# EAGLE board scooter (EAGLE 4.11)
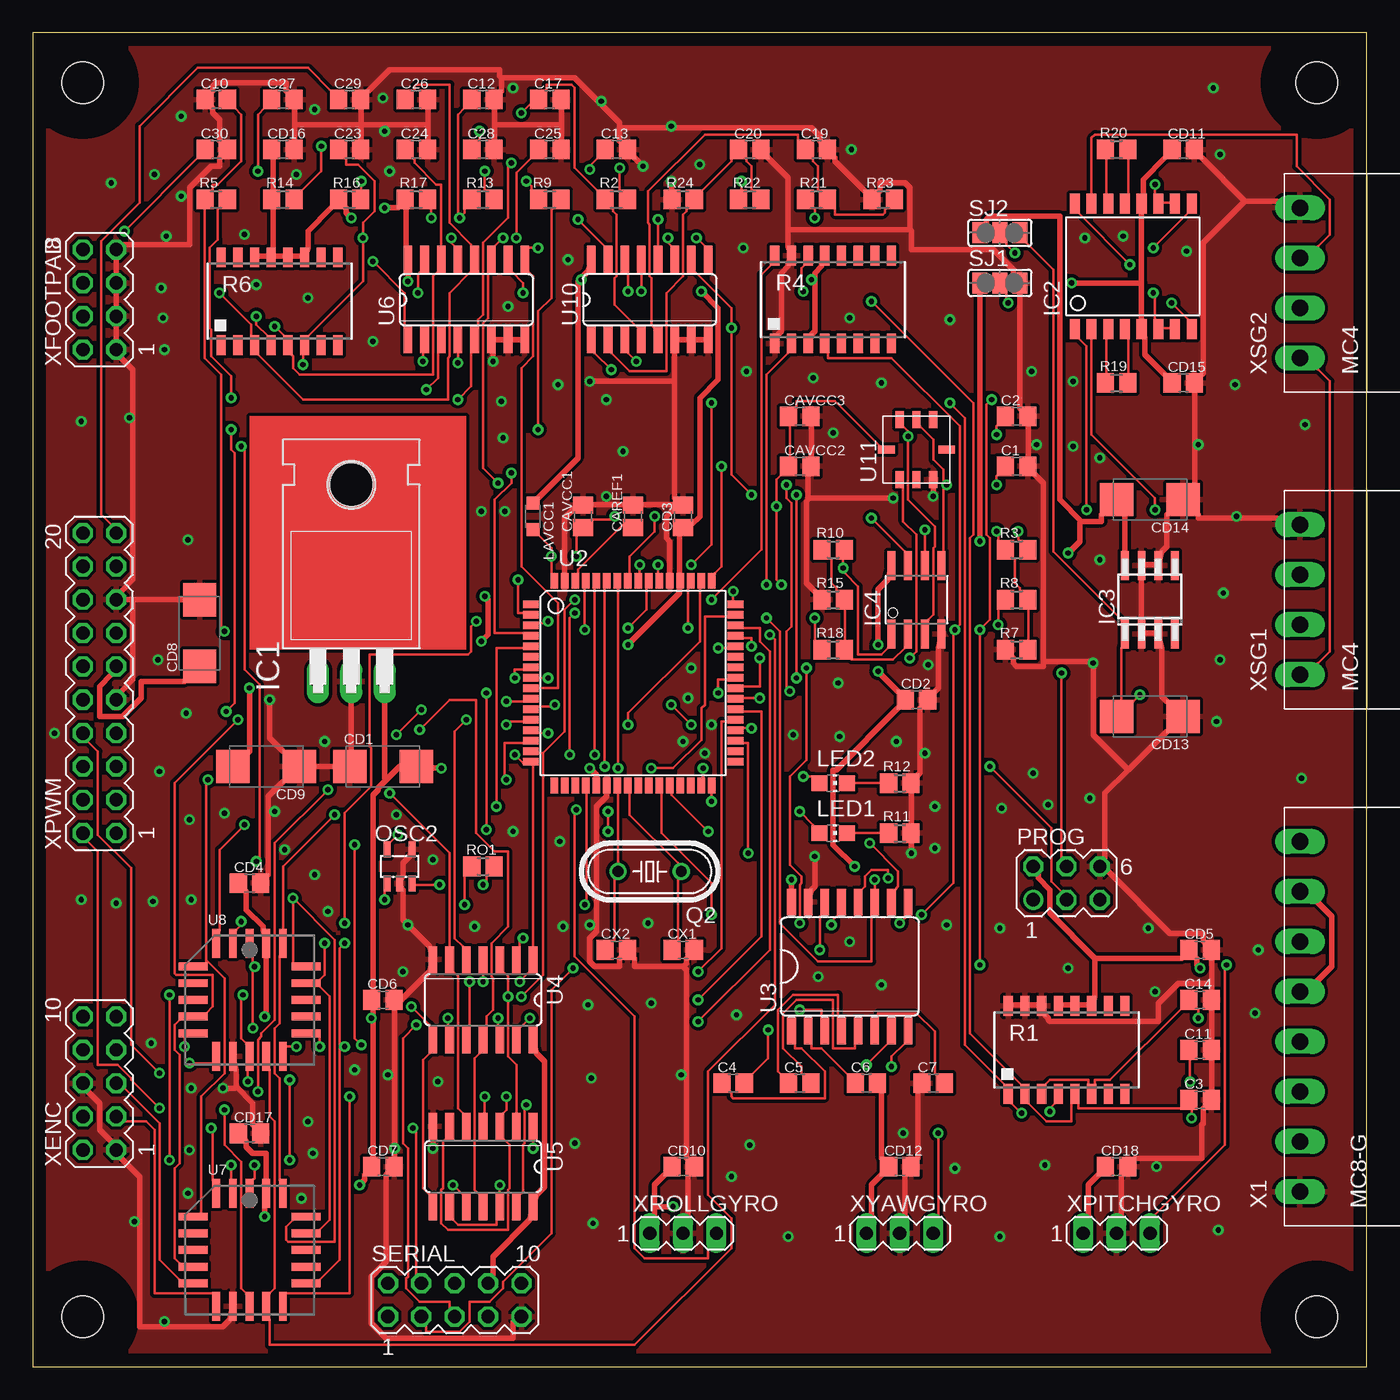
[diagram p5: board, top side]
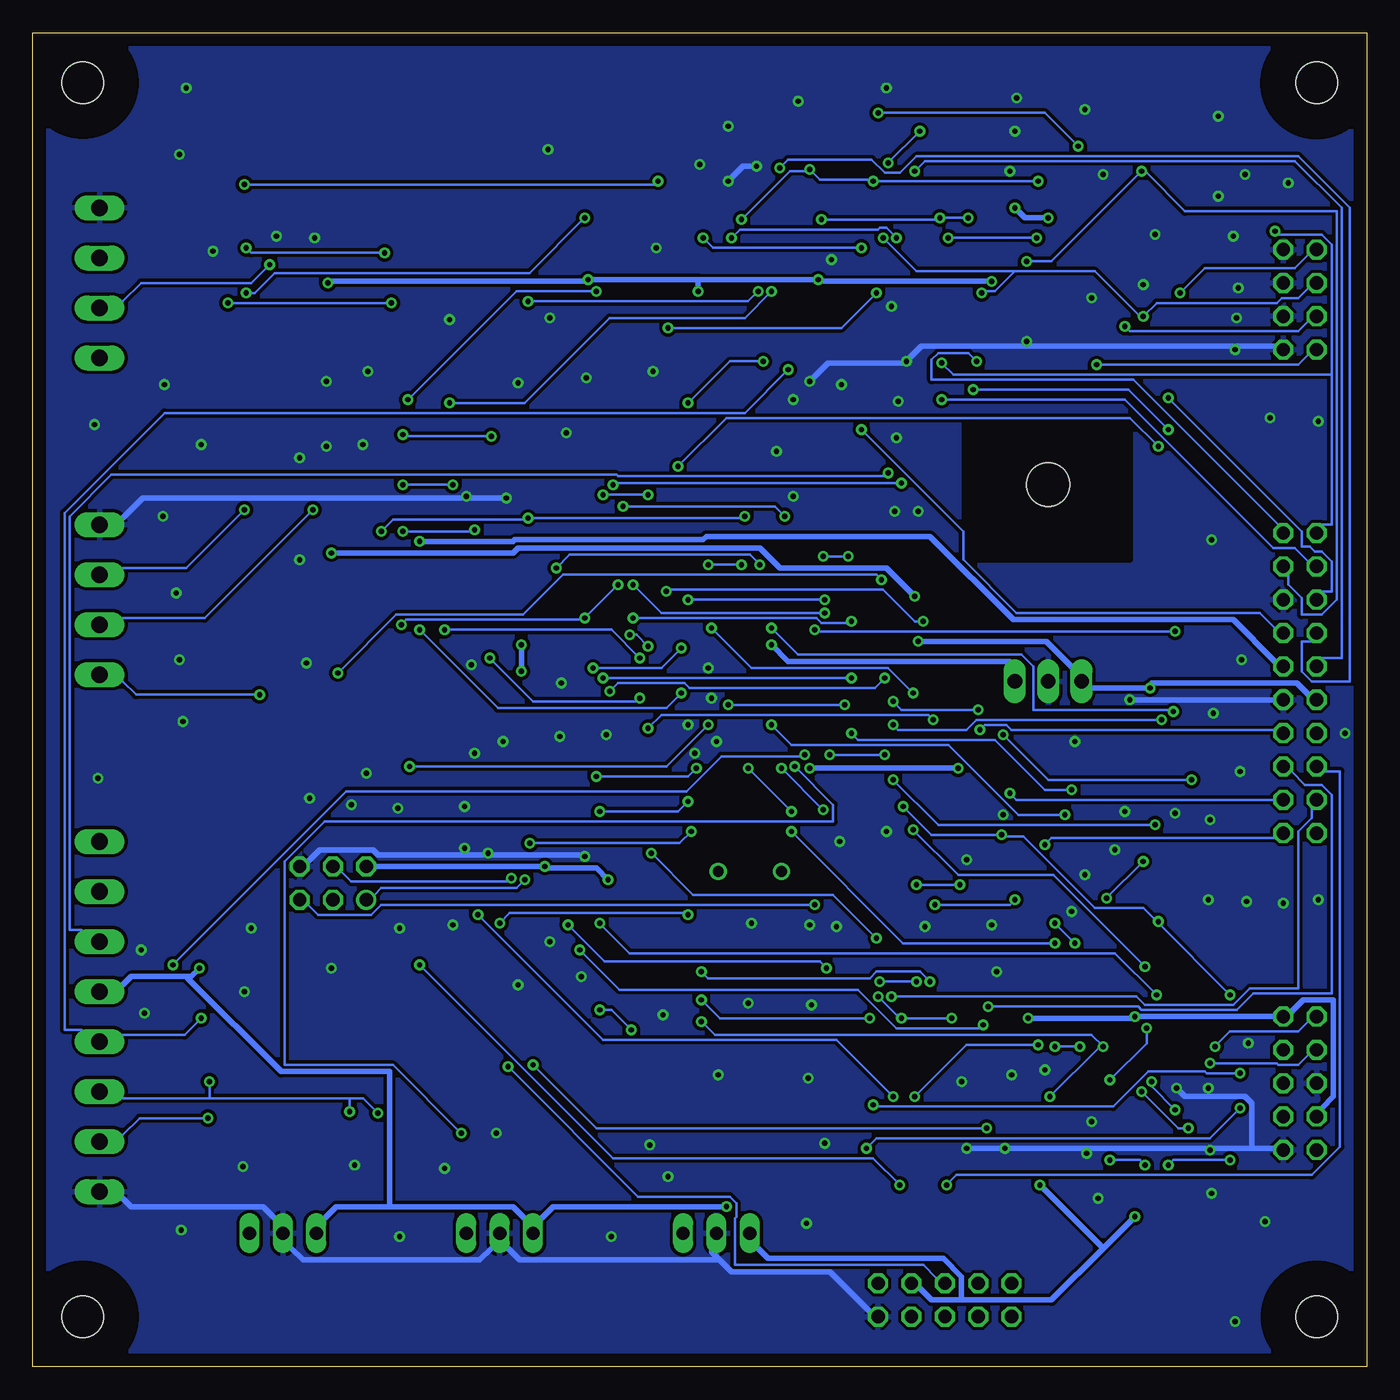
[diagram p6: board, bottom side, seen from below]

Size 101.6 x 101.6 mm. Coordinates in mm from the lower left corner, seen from the top.
Outline: 0,0 101.6,0 101.6,101.6 0,101.6 0,0
Copper layers (1*16): Top 0.035mm / dielectric 1.5mm / Bottom 0.035mm
Design rules "default": minimum track width 7mil, minimum drill 16mil, track to track 8mil, track to pad 8mil, pad to pad 8mil, via to via 8mil, smd to smd 8mil, copper to edge 40mil, drill to drill 8mil, minimum pad ring 10mil, minimum via ring 8mil, stop-mask expansion 4mil, vias tented up to drill 0mil, thermal gap 10mil
Net classes: 1 pwr: width 0.406 mm; 2 bigpwr: width 0.914 mm, clearance 0.813 mm; 3 ugpwr: width 0.61 mm, clearance 0.61 mm
Holes 3.17 mm at 3.81,97.79 97.79,3.81 3.81,3.81 97.79,97.79
tRestrict: area 0,94 to 7.6,101.6; area 94,94 to 101.6,101.6; area 94,0 to 101.6,7.6; area 0,0 to 7.6,7.6
bRestrict: area 18,61.5 to 30.6,72.1; area 0,94 to 7.6,101.6; area 94,94 to 101.6,101.6; area 94,0 to 101.6,7.6; area 0,0 to 7.6,7.6

## Footprints (pad centres in the part's own frame; a part is rotated, then mirrored left to right if it is on the bottom)
C0805 = smd 1.3 x 1.5: 1 -0.85,0; 2 0.85,0
C/6032-28R = smd 2.55 x 2.5: + 2.525,0; - -2.525,0
TO220H = drill 1.118 long: 1 -2.54,-10.16; 2 0,-10.16; 3 2.54,-10.16 | hole 3.302: 0,4.826
SO16-1 = smd 0.762 x 1.524: 1 -4.445,-4.775; 2 -3.175,-4.775; 3 -1.905,-4.775; 4 -0.635,-4.775; 5 0.635,-4.775; 6 1.905,-4.775; 7 3.175,-4.775; 8 4.445,-4.775; 9 4.445,4.775; 10 3.175,4.775; 11 1.905,4.775; 12 0.635,4.775; 13 -0.635,4.775; 14 -1.905,4.775; 15 -3.175,4.775; 16 -4.445,4.775
SO08 = smd 0.6 x 2.2: 1 -1.905,-2.6; 2 -0.635,-2.6; 3 0.635,-2.6; 4 1.905,-2.6; 5 1.905,2.6; 6 0.635,2.6; 7 -0.635,2.6; 8 -1.905,2.6
SO08' = smd 0.61 x 2.21: 1 -1.905,-2.616; 2 -0.635,-2.616; 3 0.635,-2.616; 4 1.905,-2.616; 5 1.905,2.616; 6 0.635,2.616; 7 -0.635,2.616; 8 -1.905,2.616
L2012C = smd 1 x 1: 1 -1,0; 2 1,0
CHIP-LED0805 = smd 1.2 x 1.2: A 0,-1.05; C 0,1.05
SOT23-5L = smd 0.55 x 1.2: 1 -0.95,-1.3; 2 0,-1.3; 3 0.95,-1.3; 4 0.95,1.3; 5 -0.95,1.3
MA03-2 = drill 1.016 round: 1 -2.54,-1.27 | drill 1.016 octagon: 2 -2.54,1.27; 3 0,-1.27; 4 0,1.27; 5 2.54,-1.27; 6 2.54,1.27
HC49/S = drill 0.813 round: 1 -2.413,0; 2 2.413,0
4816P = smd 0.7 x 1.5: 1 -4.445,-3.346; 2 -3.175,-3.346; 3 -1.905,-3.346; 4 -0.635,-3.346; 5 0.635,-3.346; 6 1.905,-3.346; 7 3.175,-3.346; 8 4.445,-3.346; 9 4.445,3.346; 10 3.175,3.346; 11 1.905,3.346; 12 0.635,3.346; 13 -0.635,3.346; 14 -1.905,3.346; 15 -3.175,3.346; 16 -4.445,3.346
R0805 = smd 1.3 x 1.5: 1 -0.85,0; 2 0.85,0
MA05-2 = drill 1.016 octagon: 1 -5.08,-1.27; 2 -5.08,1.27; 3 -2.54,-1.27; 4 -2.54,1.27; 5 0,-1.27; 6 0,1.27; 7 2.54,-1.27; 8 2.54,1.27; 9 5.08,-1.27; 10 5.08,1.27
SJ_2 = smd 1.168 x 1.6: 1 -1.524,0; 2 0,0; 3 1.524,0
TQFP64 = smd 1.194 x 0.559: 1 -7.8,6; 2 -7.8,5.2; 3 -7.8,4.4; 4 -7.8,3.6; 5 -7.8,2.8; 6 -7.8,2; 7 -7.8,1.2; 8 -7.8,0.4; 9 -7.8,-0.4; 10 -7.8,-1.2; 11 -7.8,-2; 12 -7.8,-2.8; 13 -7.8,-3.6; 14 -7.8,-4.4; 15 -7.8,-5.2; 16 -7.8,-6; 33 7.8,-6; 34 7.8,-5.2; 35 7.8,-4.4; 36 7.8,-3.6; 37 7.8,-2.8; 38 7.8,-2; 39 7.8,-1.2; 40 7.8,-0.4; 41 7.8,0.4; 42 7.8,1.2; 43 7.8,2; 44 7.8,2.8; 45 7.8,3.6; 46 7.8,4.4; 47 7.8,5.2; 48 7.8,6 | smd 0.559 x 1.194: 17 -6,-7.8; 18 -5.2,-7.8; 19 -4.4,-7.8; 20 -3.6,-7.8; 21 -2.8,-7.8; 22 -2,-7.8; 23 -1.2,-7.8; 24 -0.4,-7.8; 25 0.4,-7.8; 26 1.2,-7.8; 27 2,-7.8; 28 2.8,-7.8; 29 3.6,-7.8; 30 4.4,-7.8; 31 5.2,-7.8; 32 6,-7.8; 49 6,7.8; 50 5.2,7.8; 51 4.4,7.8; 52 3.6,7.8; 53 2.8,7.8; 54 2,7.8; 55 1.2,7.8; 56 0.4,7.8; 57 -0.4,7.8; 58 -1.2,7.8; 59 -2,7.8; 60 -2.8,7.8; 61 -3.6,7.8; 62 -4.4,7.8; 63 -5.2,7.8; 64 -6,7.8
SO16L = smd 0.66 x 2.032: 1 -4.445,-4.902; 2 -3.175,-4.902; 3 -1.905,-4.902; 4 -0.635,-4.902; 5 0.635,-4.902; 6 1.905,-4.902; 7 3.175,-4.902; 8 4.445,-4.902; 9 4.445,4.902; 10 3.175,4.902; 11 1.905,4.902; 12 0.635,4.902; 13 -0.635,4.902; 14 -1.905,4.902; 15 -3.175,4.902; 16 -4.445,4.902
SO14 = smd 0.66 x 2.032: 1 -3.81,-3.073; 2 -2.54,-3.073; 3 -1.27,-3.073; 4 0,-3.073; 5 1.27,-3.073; 6 2.54,-3.073; 7 3.81,-3.073; 8 3.81,3.073; 9 2.54,3.073; 10 1.27,3.073; 11 0,3.073; 12 -1.27,3.073; 13 -2.54,3.073; 14 -3.81,3.073
SO16 = smd 0.66 x 2.032: 1 -4.445,-3.073; 2 -3.175,-3.073; 3 -1.905,-3.073; 4 -0.635,-3.073; 5 0.635,-3.073; 6 1.905,-3.073; 7 3.175,-3.073; 8 4.445,-3.073; 9 4.445,3.073; 10 3.175,3.073; 11 1.905,3.073; 12 0.635,3.073; 13 -0.635,3.073; 14 -1.905,3.073; 15 -3.175,3.073; 16 -4.445,3.073
PLCC20 = smd 0.6 x 2.2: 1 0,4.3; 2 -1.27,4.3; 3 -2.54,4.3; 9 -2.54,-4.3; 10 -1.27,-4.3; 11 0,-4.3; 12 1.27,-4.3; 13 2.54,-4.3; 19 2.54,4.3; 20 1.27,4.3 | smd 2.2 x 0.6: 4 -4.3,2.54; 5 -4.3,1.27; 6 -4.3,0; 7 -4.3,-1.27; 8 -4.3,-2.54; 14 4.3,-2.54; 15 4.3,-1.27; 16 4.3,0; 17 4.3,1.27; 18 4.3,2.54
E-8 = smd 1.27 x 0.635: 1 -2.286,1.27; 2 -2.286,0; 3 -2.286,-1.27; 5 2.286,-1.27; 6 2.286,0; 7 2.286,1.27 | smd 0.635 x 1.27: 4 0,-2.286; 8 0,2.286
MC8-G = drill 1.27 long: 1 -13.335,0; 2 -9.525,0; 3 -5.715,0; 4 -1.905,0; 5 1.905,0; 6 5.715,0; 7 9.525,0; 8 13.335,0
MA04-2 = drill 1.016 octagon: 1 -3.81,-1.27; 2 -3.81,1.27; 3 -1.27,-1.27; 4 -1.27,1.27; 5 1.27,-1.27; 6 1.27,1.27; 7 3.81,-1.27; 8 3.81,1.27
MA03-1 = drill 1.016 long: 1 -2.54,0; 2 0,0; 3 2.54,0
MA10-2 = drill 1.016 octagon: 1 -11.43,-1.27; 2 -11.43,1.27; 3 -8.89,-1.27; 4 -8.89,1.27; 5 -6.35,-1.27; 6 -6.35,1.27; 7 -3.81,-1.27; 8 -3.81,1.27; 9 -1.27,-1.27; 10 -1.27,1.27; 11 1.27,-1.27; 12 1.27,1.27; 13 3.81,-1.27; 14 3.81,1.27; 15 6.35,-1.27; 16 6.35,1.27; 17 8.89,-1.27; 18 8.89,1.27; 19 11.43,-1.27; 20 11.43,1.27
MC4 = drill 1.27 long: 1 -5.715,0; 2 -1.905,0; 3 1.905,0; 4 5.715,0

## Placement (x,y rotation side)
C1  0.22uF  [C0805]  74.93,68.58 0 top
C2  0.22uF  [C0805]  74.93,72.39 0 top
C3  0.1uF  [C0805]  88.9,20.32 0 top
C4  1.0uF  [C0805]  53.34,21.59 0 top
C5  1.0uF  [C0805]  58.42,21.59 0 top
C6  1.0uF  [C0805]  63.5,21.59 0 top
C7  1.0uF  [C0805]  68.58,21.59 0 top
C10  0.1uF  [C0805]  13.97,96.52 0 top
C11  0.1uF  [C0805]  88.9,24.13 0 top
C12  0.1uF  [C0805]  34.29,96.52 0 top
C13  0.1uF  [C0805]  44.45,92.71 0 top
C14  0.1uF  [C0805]  88.9,27.94 0 top
C17  0.1uF  [C0805]  39.37,96.52 0 top
C19  1.0uF  [C0805]  59.69,92.71 0 top
C20  1.0uF  [C0805]  54.61,92.71 0 top
C23  0.1uF  [C0805]  24.13,92.71 0 top
C24  0.1uF  [C0805]  29.21,92.71 0 top
C25  0.1uF  [C0805]  39.37,92.71 0 top
C26  0.1uF  [C0805]  29.21,96.52 0 top
C27  0.1uF  [C0805]  19.05,96.52 0 top
C28  0.1uF  [C0805]  34.29,92.71 0 top
C29  0.1uF  [C0805]  24.13,96.52 0 top
C30  0.1uF  [C0805]  13.97,92.71 0 top
CAREF1  0.1uF  [C0805]  45.72,64.77 90 top
CAVCC1  0.1uF  [C0805]  41.91,64.77 90 top
CAVCC2  0.1uF  [C0805]  58.42,68.58 0 top
CAVCC3  0.1uF  [C0805]  58.42,72.39 0 top
CD1  10uF 25v  [C/6032-28R]  26.67,45.72 0 top
CD2  0.1uF  [C0805]  67.31,50.8 0 top
CD3  0.1uF  [C0805]  49.53,64.77 90 top
CD4  0.1uF  [C0805]  16.51,36.83 0 top
CD5  0.1uF  [C0805]  88.9,31.75 0 top
CD6  0.1uF  [C0805]  26.67,27.94 0 top
CD7  0.1uF  [C0805]  26.67,15.24 0 top
CD8  10uF 25v  [C/6032-28R]  12.7,55.88 90 top
CD9  10uF 25v  [C/6032-28R]  17.78,45.72 180 top
CD10  0.1uF  [C0805]  49.53,15.24 0 top
CD11  0.1uF  [C0805]  87.63,92.71 0 top
CD12  0.1uF  [C0805]  66.04,15.24 0 top
CD13  10uF 25v  [C/6032-28R]  85.09,49.53 180 top
CD14  10uF 25v  [C/6032-28R]  85.09,66.04 180 top
CD15  0.1uF  [C0805]  87.63,74.93 0 top
CD16  0.1uF  [C0805]  19.05,92.71 0 top
CD17  0.1uF  [C0805]  16.51,17.78 0 top
CD18  0.1uF  [C0805]  82.55,15.24 0 top
CX1  18p  [C0805]  49.53,31.75 0 top
CX2  18p  [C0805]  44.45,31.75 0 top
IC1  7805T  [TO220H]  24.26,62.36 0 top
IC2  INA2128U  [SO16-1]  83.82,83.82 0 top
IC3  TL750L010C  [SO08]  85.09,58.42 0 top
IC4  OPA2340U  [SO08']  67.31,58.42 0 top
LAVCC1  10uH  [L2012C]  38.1,64.77 270 top
LED1  [CHIP-LED0805]  60.96,40.64 270 top
LED2  [CHIP-LED0805]  60.96,44.45 270 top
OSC2  LTC1799S5  [SOT23-5L]  27.94,38.1 0 top
PROG  [MA03-2]  78.74,36.83 0 top
Q2  14.7  [HC49/S]  46.99,37.72 180 top
R1  10k  [4816P]  78.74,24.13 0 top
R2  10k 0.1%  [R0805]  44.45,88.9 0 top
R3  10k 1%  [R0805]  74.93,62.23 0 top
R4  10k  [4816P]  60.96,81.28 0 top
R5  10k  [R0805]  13.97,88.9 0 top
R6  4.7k  [4816P]  18.8,81.15 0 top
R7  10k 1%  [R0805]  74.93,54.61 0 top
R8  10k 1%  [R0805]  74.93,58.42 0 top
R9  10k 0.1%  [R0805]  39.37,88.9 0 top
R10  10k 1%  [R0805]  60.96,62.23 0 top
R11  1k  [R0805]  66.04,40.64 0 top
R12  1k  [R0805]  66.04,44.45 0 top
R13  10k 0.1%  [R0805]  34.29,88.9 0 top
R14  10k 0.1%  [R0805]  19.05,88.9 0 top
R15  10k 1%  [R0805]  60.96,58.42 0 top
R16  10k 0.1%  [R0805]  24.13,88.9 0 top
R17  10k 0.1%  [R0805]  29.21,88.9 0 top
R18  10k 1%  [R0805]  60.96,54.61 0 top
R19  400  [R0805]  82.55,74.93 0 top
R20  400  [R0805]  82.55,92.71 0 top
R21  10k 0.1%  [R0805]  59.69,88.9 0 top
R22  10k 0.1%  [R0805]  54.61,88.9 0 top
R23  10k 0.1%  [R0805]  64.77,88.9 0 top
R24  10k 0.1%  [R0805]  49.53,88.9 0 top
RO1  10k 1%  [R0805]  34.29,38.1 0 top
SERIAL  [MA05-2]  32.13,5.08 0 top
SJ1  [SJ_2]  73.66,82.55 0 top
SJ2  [SJ_2]  73.66,86.36 0 top
U2  MEGA128-A  [TQFP64]  45.72,52.07 0 top
U3  MAX232ECWE  [SO16L]  62.23,30.48 0 top
U4  74HC08D  [SO14]  34.29,27.94 180 top
U5  74HC02D  [SO14]  34.29,15.24 180 top
U6  4051D  [SO16]  33.02,81.28 0 top
U7  HCTL-2016#PLC  [PLCC20]  16.51,8.89 0 top
U8  HCTL-2016#PLC  [PLCC20]  16.51,27.94 0 top
U10  4051D  [SO16]  46.99,81.28 0 top
U11  ADXL311JE  [E-8]  67.31,69.85 90 top
X1  MC8-G  [MC8-G]  96.52,26.67 90 top
XENC  [MA05-2]  5.08,21.59 90 top
XFOOTPAD  [MA04-2]  5.08,81.28 90 top
XPITCHGYRO  [MA03-1]  82.55,10.16 0 top
XPWM  [MA10-2]  5.08,52.07 90 top
XROLLGYRO  [MA03-1]  49.53,10.16 0 top
XSG1  MC4  [MC4]  96.52,58.42 90 top
XSG2  MC4  [MC4]  96.52,82.55 90 top
XYAWGYRO  [MA03-1]  66.04,10.16 0 top

## Tracks (layer width: path | path; a pad name or v marks a point on that pad's centre or on a via)
+15V  (via drill 0.41)
  Top 0.406: v16.51,51.69 16.51,46.86 CD9.+ | 79.88,64.39 78.23,66.04 78.23,87.63 72.9,87.63 72.64,87.38 72.64,87.12 SJ2.1 | 79.88,64.39 81.41,64.39 81.41,64.9 CD14.+ 83.19,64.9 IC3.8 | v34.16,55.24 34.67,55.75 34.67,58.42 v34.42,58.67 | v78.87,61.98 79.76,62.87 79.76,64.26 79.88,64.39
  Bottom 0.406: XPWM.10 4.45,51.18 5.33,52.07 16.38,52.07 v16.51,51.69 20.95,51.69 IC1.1 22.48,53.34 24.38,55.24 v34.16,55.24 | v34.42,58.67 36.58,60.83 44.7,60.83 46.23,62.36 64.64,62.36 65.02,61.98 v78.87,61.98
-15V  (via drill 0.41)
  Top 0.406: v72.14,62.87 SJ1.1 | CD8.- 11.56,52.2 8.26,52.2 8.26,50.93 6.86,49.53 5.08,49.53 5.08,51.82 5.97,52.7 XPWM.11
  Bottom 0.406: v72.14,62.87 65.02,62.87 64.9,62.99 50.55,62.99 50.29,63.25 33.27,63.25 26.92,56.9 10.16,56.9 6.99,53.72 XPWM.11
/RESET  (via drill 0.41)
  Top 0.178: v42.04,35.18 42.16,35.31 42.16,43.69 U2.20
  Bottom 0.178: v42.04,35.18 75.06,35.18 75.82,34.42 79.88,34.42 80.64,35.18 PROG.5
ACCEL_ST  (via drill 0.41)
  Top 0.178: v55.37,50.93 54.1,50.93 U2.39 | v66.8,53.98 67.31,54.48 67.31,63.37 66.29,64.39 66.29,67.06 U11.1
  Bottom 0.178: v55.37,50.93 55.63,50.67 63.5,50.67 v66.8,53.98
ADCMUX1  (via drill 0.41)
  Top 0.178: v47.62,61.09 47.62,60.45 U2.54 | v50.16,61.09 51.69,62.61 v51.69,73.41 | v45.97,76.58 45.34,77.22 U10.3
  Bottom 0.178: v47.62,61.09 v50.16,61.09 | v51.69,73.41 48.51,76.58 v45.97,76.58
ADCMUX2  (via drill 0.41)
  Top 0.178: v45.34,56.26 46.74,57.66 46.74,59.31 U2.55 | v14.73,49.91 15.37,50.55 15.37,69.6 15.11,69.85 v15.11,71.37 | v29.97,74.42 30.86,75.31 30.86,77.22 U6.3
  Bottom 0.178: v45.34,56.26 43.31,54.23 26.29,54.23 25.4,53.34 25.4,50.04 14.86,50.04 v14.73,49.91 | v15.11,71.37 18.16,74.42 v29.97,74.42
AHI1  (via drill 0.41)
  Top 0.178: U5.2 36.83,22.99 36.2,23.62 v36.2,28.19 36.2,29.72 35.81,30.1 U4.3
  Bottom 0.178: v36.2,28.19 17.53,28.19 16.89,27.56 10.16,27.56 8.89,28.83 5.21,28.83 5.21,40.77 4.19,41.78 4.19,42.55 XPWM.4
AHI2  (via drill 0.41)
  Top 0.178: U5.8 30.23,13.08 29.72,13.59 29.72,23.37 30.23,23.88 U4.8 30.23,25.78 30.23,26.04 v28.83,27.43
  Bottom 0.178: v28.83,27.43 17.4,27.43 17.14,27.18 9.91,27.18 8.64,28.45 2.67,28.45 2.67,43.56 3.43,44.32 4.7,44.32 5.71,45.34 XPWM.5
ALO1  (via drill 0.41)
  Top 0.178: v9.65,19.68 7.49,21.84 7.49,21.97 6.48,22.99 4.95,22.99 4.95,39.24 4.19,40.01 XPWM.2 | v38.1,16.64 U5.1
  Bottom 0.178: v38.1,16.64 37.34,17.4 11.94,17.4 v9.65,19.68
ALO2  (via drill 0.41)
  Top 0.178: v32,13.84 32.77,13.08 U5.10
  Bottom 0.178: v32,13.84 31.24,14.61 4.19,14.61 2.03,16.76 2.03,45.34 3.17,45.34 XPWM.6
AREF
  Top 0.178: U2.62 41.53,60.45 41.53,60.71 45.09,64.26 CAREF1.1
AVCC1  (via drill 0.41)
  Top 0.178: U11.8 64.52,70.1 61.09,73.53 58.17,73.53 58.17,73.03 CAVCC3.1 57.66,71.75 57.66,69.22 CAVCC2.1 57.02,67.94 56.64,67.56 v56.64,65.53 56.64,59.94 v57.02,59.56 | LAVCC1.2 38.48,63.37 39.5,62.36 v39.5,61.72 39.5,60.45 U2.64 | v41.4,61.72 41.4,63.37 CAVCC1.1 42.55,64.52 44.32,64.52 v44.32,64.77 | v59.56,57.02 59.56,55.24 R18.1 | v73.53,56.52 73.53,57.78 R8.1
  Bottom 0.178: v39.5,61.72 v41.4,61.72 | v57.02,59.56 v59.56,57.02 59.94,56.9 73.15,56.9 v73.53,56.52 | v44.32,64.77 45.09,65.53 v56.64,65.53
BAT_VOLTAGE  (via drill 0.41)
  Top 0.178: v42.04,56.13 42.04,59.31 U2.61 | v14.61,56.01 14.35,56.26 14.35,75.56 13.08,76.83 13.08,88.27 R5.1 13.72,89.53 13.72,90.04 14.1,90.04 15.88,91.82 15.88,95.38 15.37,95.89 C10.2
  Bottom 0.178: v42.04,56.13 41.91,56.01 v14.61,56.01
BATIS  (via drill 0.41)
  Top 0.178: v21.97,92.96 21.97,91.06 20.45,89.53 R14.2 | v37.21,95.5 37.97,96.27 C17.1 39.12,97.16 39.12,97.66 41.02,97.66 41.27,97.41 41.27,91.31 43.05,89.53 R2.1 44.2,88.27 44.2,88.01 44.45,87.76 44.45,83.06 44.32,82.93 44.32,80.9 46.1,79.12 U10.4
  Bottom 0.178: v21.97,92.96 24.51,95.5 v37.21,95.5
BATISIN  (via drill 0.41)
  Top 0.178: v44.7,91.31 44.7,89.53 R2.2
  Bottom 0.178: v44.7,91.31 44.07,91.95 37.72,91.95 36.7,90.93 35.56,90.93 34.29,92.2 5.21,92.2 1.27,88.27 1.27,52.2 4.19,52.2 4.95,52.96 4.95,55.24 4.19,55.24 XPWM.14
BEEPER  (via drill 0.41)
  Top 0.178: v36.45,68.07 36.45,67.31 35.18,66.04 35.18,55.88 37.34,55.88 U2.4
  Bottom 0.178: v36.45,68.07 36.7,67.82 57.02,67.82 57.15,67.94 95.63,67.94 98.81,64.77 98.81,33.27 97.92,33.27 X1.6
BHI1  (via drill 0.41)
  Top 0.178: U5.5 32.77,19.3 32.38,19.68 32.38,29.72 32,30.1 U4.6 31.75,39.12 v27.18,43.69
  Bottom 0.178: v27.18,43.69 26.67,43.18 XPWM.3
BHI2  (via drill 0.41)
  Top 0.178: U5.11 34.04,13.08 33.66,13.46 33.66,23.5 34.04,23.88 U4.11 34.54,25.78 34.54,26.67 35.05,27.18 35.05,29.59 34.92,29.72 34.92,32.26 36.2,33.53 36.2,39.24 35.18,39.24 33.78,40.64 33.78,50.8 31.75,50.8 v29.46,48.51
  Bottom 0.178: v29.46,48.51 29.08,48.9 27.43,48.9 27.05,48.51 6.99,48.51 XPWM.7
BLO1  (via drill 0.41)
  Top 0.178: v34.42,20.57 34.42,19.3 U5.4 | v25.02,24.51 24.51,25.02 v24.51,39.75
  Bottom 0.178: v34.42,20.57 30.48,24.51 v25.02,24.51 | v24.51,39.75 24,40.26 6.99,40.26 XPWM.1
BLO2  (via drill 0.41)
  Top 0.178: v37.59,19.94 37.47,19.81 37.47,17.02 37.34,16.89 37.34,13.34 37.08,13.08 U5.13 | v9.65,22.35 7.49,24.51 7.49,37.97 4.95,40.51 4.95,46.86 4.19,47.62 XPWM.8
  Bottom 0.178: v37.59,19.94 37.47,19.81 19.3,19.81 16.64,22.48 12.32,22.48 12.19,22.35 v9.65,22.35
D0  (via drill 0.41)
  Top 0.178: v49.91,56.26 49.91,59.31 U2.51 | v34.54,40.89 v34.54,51.31 | U8.1 16.76,31.24 16.76,30.61 v16.89,30.48 16.76,30.1 v16.76,25.78 | v16.89,15.37 16.89,14.35 16.76,14.22 U7.1 | v19.56,15.75 v19.56,21.84
  Bottom 0.178: v49.91,56.26 46.86,53.21 36.45,53.21 v34.54,51.31 | v34.54,40.89 31.11,37.47 23.88,37.47 v16.89,30.48 | v16.89,15.37 17.27,15.75 v19.56,15.75 | v19.56,21.84 16.76,24.64 v16.76,25.78
D1  (via drill 0.41)
  Top 0.178: v45.34,48.9 45.34,49.78 50.8,55.24 50.8,59.31 U2.50 | v22.99,42.04 19.05,38.1 U8.19 18.8,31.24 18.8,26.16 18.41,25.78 18.41,22.35 18.8,21.97 18.8,14.22 U7.19
  Bottom 0.178: v45.34,48.9 43.81,47.37 31.88,47.37 26.54,42.04 v22.99,42.04
D2  (via drill 0.41)
  Top 0.178: v52.45,68.58 52.45,60.96 51.94,60.45 U2.49 | v15.88,70.1 16.13,69.85 16.13,53.09 17.27,51.94 17.27,38.73 v17.02,38.48 | U8.18 19.81,30.73 v19.81,35.69 22.99,32.51 22.99,9.53 19.43,9.53 19.3,9.65 19.3,10.67 19.81,11.18 U7.18
  Bottom 0.178: v52.45,68.58 48.77,72.26 18.03,72.26 v15.88,70.1 | v19.81,35.69 v17.02,38.48
D3  (via drill 0.41)
  Top 0.178: v53.34,59.05 53.34,58.29 U2.48 | v33.78,56.77 33.4,56.39 33.4,54.48 33.15,54.23 25.65,54.23 25.65,47.24 25.78,47.12 25.78,44.2 23.75,42.16 v23.75,33.78 | v22.23,32.26 22.23,29.84 21.84,29.46 U8.17 21.84,28.96 22.61,28.19 22.61,11.18 21.84,10.41 U7.17
  Bottom 0.178: v53.34,59.05 53.21,59.18 36.83,59.18 34.42,56.77 v33.78,56.77 | v22.23,32.26 v23.75,33.78
D4  (via drill 0.41)
  Top 0.178: v47.12,45.59 48.77,45.59 50.93,47.75 50.93,50.16 51.18,50.42 51.18,57.15 52.96,57.15 U2.47 | v43.81,40.77 v43.81,42.29 | v23.75,32.26 23.37,31.88 23.37,24.38 | 23.37,24.38 23.37,8.13 21.84,6.6 U7.14 | v21.84,24.38 21.84,25.15 U8.14 | 23.37,24.38 v23.75,24.38
  Bottom 0.178: v43.81,42.29 v47.12,45.59 | v43.81,40.77 35.31,32.26 v23.75,32.26 | v23.75,24.38 v21.84,24.38
D5  (via drill 0.41)
  Top 0.178: v50.67,26.29 56.13,31.75 56.13,54.48 55.37,55.24 55.37,56.26 54.1,56.26 U2.46 | v20.07,24.38 19.3,24.38 U8.13 | v24.13,20.57 24.13,5.59 19.3,5.59 U7.13
  Bottom 0.178: v50.67,26.29 49.66,25.27 20.95,25.27 v20.07,24.38 20.45,24.26 v24.13,20.57
D6  (via drill 0.41)
  Top 0.178: v54.74,54.86 54.74,55.5 54.1,55.5 U2.45 | v56.13,55.75 56.52,55.37 56.52,27.56 51.44,22.48 51.44,13.08 53.21,11.3 53.21,9.02 45.85,1.65 18.03,1.65 18.03,3.56 U7.12 18.03,5.59 18.41,5.97 18.41,18.67 18.03,19.05 18.03,22.61 U8.12
  Bottom 0.178: v54.74,54.86 55.63,55.75 v56.13,55.75
D7  (via drill 0.41)
  Top 0.178: v52.2,54.74 52.96,54.74 U2.44 | v58.93,53.21 58.93,46.23 57.66,44.96 57.66,38.23 58.55,37.34 58.55,36.83 58.42,36.7 v58.42,33.78 | v16,28.32 15.88,28.19 15.88,25.02 16.26,24.64 U8.11 16.38,22.61 v16.38,21.72 | v14.61,19.56 14.61,16.89 15.88,15.62 15.88,5.97 16.26,5.59 U7.11
  Bottom 0.178: v52.2,54.74 53.72,53.21 v58.93,53.21 | v58.42,33.78 56.13,31.5 19.18,31.5 v16,28.32 | v14.61,19.56 16.38,21.34 v16.38,21.72
ENC1A
  Top 0.178: U7.9 13.72,5.59 9.27,5.59 9.27,18.03 8.64,18.67 6.99,18.67 XENC.3
ENC1B
  Top 0.178: U7.8 11.18,6.6 9.65,8.13 9.65,18.54 6.99,21.21 XENC.5
ENC2A  (via drill 0.41)
  Top 0.178: v11.94,23.11 13.72,23.11 U8.9
  Bottom 0.178: v11.94,23.11 6.86,23.11 6.73,22.99 5.21,22.99 4.45,23.75 XENC.8
ENC2B  (via drill 0.41)
  Top 0.178: v11.56,24.38 11.56,25.15 U8.8
  Bottom 0.178: v11.56,24.38 10.41,25.53 5.21,25.53 4.45,26.29 XENC.10
ENCCLK  (via drill 0.41)
  Top 0.178: v35.31,42.67 35.31,54.74 37.34,54.74 U2.5 | v27.81,40.51 27.18,39.88 OSC2.5 | v15.11,15.37 15.11,14.22 U7.2 | v10.41,15.75 v10.41,28.32 | v15.88,33.91 15.88,33.66 15.49,33.27 U8.2
  Bottom 0.178: v35.31,42.67 33.15,40.51 v27.81,40.51 27.43,40.39 26.16,40.39 20.7,34.92 17.02,34.92 16,33.91 | v15.11,15.37 14.73,15.75 v10.41,15.75 | v10.41,28.32 16,33.91 | 16,33.91 v15.88,33.91
EXTRAMUX0  (via drill 0.41)
  Top 0.178: v36.7,52.45 36.7,53.09 37.34,53.09 U2.7 | v57.66,51.44 57.4,51.69 57.4,56.01 57.78,56.39 57.78,65.79 57.4,66.17 v57.4,67.18 | v35.43,67.31 34.29,68.45 34.29,79.5 34.67,79.88 34.67,83.44 U6.11 35.18,85.34 v35.81,85.98 | v48.39,85.98 48.39,85.6 48.64,85.34 U10.11
  Bottom 0.178: v36.7,52.45 37.47,51.69 51.56,51.69 51.94,52.07 57.02,52.07 v57.66,51.44 | v57.4,67.18 57.28,67.31 v35.43,67.31 | v48.39,85.98 47.75,86.61 37.21,86.61 37.08,86.74 36.58,86.74 v35.81,85.98
EXTRAMUX1  (via drill 0.41)
  Top 0.178: v39.24,52.45 38.48,52.45 U2.8 | v58.17,52.45 v58.17,66.42 | v54.74,66.42 53.21,67.94 v53.21,79.12 53.21,80.64 50.42,83.44 U10.10 | v37.34,81.79 37.34,82.55 36.45,83.44 U6.10
  Bottom 0.178: v39.24,52.45 v58.17,52.45 | v58.17,66.42 v54.74,66.42 | v37.34,81.79 40.01,79.12 v53.21,79.12
EXTRAMUX2  (via drill 0.41)
  Top 0.178: U2.9 38.48,51.69 40.01,51.69 40.01,58.17 37.21,60.96 37.21,76.07 38.1,76.96 38.1,83.06 37.72,83.44 U6.9 37.72,85.22 v38.48,85.22 | v50.55,85.98 51.18,85.34 U10.9
  Bottom 0.178: v50.55,85.98 49.78,85.22 v38.48,85.22
FWD_ACCEL  (via drill 0.41)
  Top 0.178: v46.23,61.09 46.23,60.45 U2.56 | R10.2 61.72,61.59 v61.72,60.83 61.85,60.45 62.87,59.44 62.87,54.23 64.64,54.23 65.15,54.74 IC4.1
  Bottom 0.178: v46.23,61.09 46.99,61.85 60.71,61.85 v61.72,60.83
GND  (via drill 0.41)
  Top 0.406: U2.63 40.51,60.45 40.51,64.64 41.27,65.41 CAVCC1.2 42.55,65.66 45.09,65.66 CAREF1.2 46.35,65.66 48.9,65.66 CD3.2 | U10.8 51.18,78.23 50.42,78.23 U10.7 49.91,78.23 49.15,78.23 U10.6 48.9,75.06 | U2.53 48.51,60.45 48.51,62.87 48.26,63.12 48.26,64.77 48.9,65.41 CD3.2 | 48.9,75.06 48.9,66.17 CD3.2 | CD4.2 17.91,37.47 17.91,43.43 19.05,44.58 CD9.- | CD9.- CD1.- 24.26,46.86 IC1.2 | 7.62,58.42 11.56,58.42 CD8.+ | 7.62,58.42 XPWM.15 6.73,59.05 7.62,59.94 7.62,75.95 6.73,76.83 XFOOTPAD.1 XFOOTPAD.3 XFOOTPAD.5 XFOOTPAD.7 6.99,85.47 11.94,85.47 11.94,89.79 13.59,91.44 14.22,91.44 14.22,92.08 C30.2 14.22,93.34 14.22,95 13.72,95.5 13.72,95.89 C10.1 13.72,97.16 13.72,97.54 13.97,97.79 19.3,97.79 19.3,97.16 C27.2 19.94,95.89 19.94,94.61 | XPWM.9 6.73,51.44 7.62,52.32 7.62,58.42 | U6.8 37.21,78.23 36.45,78.23 U6.7 35.94,78.23 35.18,78.23 U6.6 35.05,77.22 v35.05,76.58 | v18.03,50.8 18.03,47.88 19.05,46.86 CD9.- | v42.42,75.06 48.9,75.06 | 76.96,53.72 76.96,67.31 76.33,67.94 C1.2 75.82,69.22 75.82,71.75 C2.2 75.18,73.03 SJ1.3 74.68,83.31 74.68,83.57 73.15,85.09 66.93,85.09 66.93,86.49 66.8,86.61 | 76.96,53.72 76.96,53.34 74.93,53.34 74.68,53.59 74.68,53.98 R7.1 | 30.1,94.61 30.1,95.89 C26.2 | 30.1,94.61 30.1,93.34 C24.2 | 19.94,94.61 19.94,93.34 CD16.2 | 25.02,94.61 25.02,95.89 C29.2 25.53,97.16 27.18,98.81 35.56,98.81 35.56,98.3 35.69,98.17 | 25.02,94.61 25.02,93.34 C23.2 | 25.02,94.61 19.94,94.61 | 25.02,94.61 30.1,94.61 | R4.1 56.77,78.61 57.02,78.87 57.02,83.31 57.53,83.82 57.53,83.95 R4.15 57.53,85.34 57.53,86.61 | 57.53,86.61 57.53,90.55 56.01,92.08 C20.2
  Top 0.406: 40.26,94.61 40.26,95.89 C17.2 | 40.26,94.61 40.26,93.34 C25.2 | 35.18,94.61 35.18,95.89 C12.2 35.69,97.16 35.69,98.17 | 35.18,94.61 35.18,93.34 C28.2 | 44.7,94.36 44.7,94.74 41.27,98.17 35.69,98.17 | 44.7,94.36 44.7,93.34 C13.2 45.85,92.08 v46.48,91.44 | v48.64,90.3 48.64,89.53 R24.1 | 35.18,94.61 40.26,94.61 | 44.7,94.36 59.31,94.36 59.94,93.73 59.94,93.34 C19.2 61.09,92.08 61.09,91.82 63.37,89.53 R23.1 64.52,89.53 64.52,90.17 66.42,90.17 66.8,89.79 66.8,86.61 | 66.8,86.61 57.53,86.61 | OSC2.4 28.7,38.86 28.19,38.35 28.19,37.34 OSC2.2 28.19,36.32 28.19,34.04 30.23,32 U4.7 30.23,30.1 28.07,27.94 CD6.2 27.56,27.3 v27.56,16.64 27.56,15.88 CD7.2 26.92,14.61 26.92,8 25.78,6.86 25.78,3.3 26.92,2.16 36.58,2.16 36.58,3.43 SERIAL.9 | 15.49,21.34 16.76,20.07 16.76,18.41 CD17.2 | 15.49,21.34 15.49,22.61 U8.10 | v30.48,16.64 U5.7 | U7.10 14.99,3.56 14.48,3.05 8.13,3.05 8.13,14.48 6.73,15.88 XENC.1 5.97,17.14 5.08,18.03 5.08,20.07 4.19,20.95 XENC.6 | v14.48,21.21 15.37,21.21 15.49,21.34 | U2.22 43.69,43.69 43.69,43.43 42.93,42.67 42.93,33.15 42.42,32.64 42.42,30.86 42.8,30.48 44.7,30.48 44.7,31.11 CX2.2 45.85,31.11 45.85,30.48 49.53,30.48 | 49.53,30.48 49.78,30.73 49.78,31.11 CX1.2 | XYAWGYRO.2 66.42,11.56 66.42,14.61 CD12.2 67.44,15.88 67.44,20.95 C7.1 | XROLLGYRO.2 49.91,11.56 49.91,14.61 CD10.2 49.78,15.88 49.78,30.23 49.53,30.48 | CAVCC3.2 59.31,71.75 59.31,69.22 CAVCC2.2 59.05,67.94 59.05,66.04 | 59.05,66.04 58.93,65.91 58.93,59.69 59.56,59.05 R15.1 | v68.58,66.29 U11.3 | v65.53,66.17 59.18,66.17 59.05,66.04 | 92.33,88.77 89.03,92.08 CD11.2 | 92.33,88.77 94.74,88.77 XSG2.4
  Top 0.406: CD14.- 88.52,67.18 88.52,74.3 CD15.2 89.03,75.56 89.15,75.69 89.15,85.6 92.33,88.77 | CD14.- 86.36,64.9 86.36,62.48 85.98,62.1 IC3.6 85.47,61.09 84.71,61.09 IC3.7 IC3.2 84.71,55.88 85.47,55.88 IC3.3 85.98,54.74 85.98,51.05 86.36,50.67 CD13.- 86.36,48.39 83.44,45.47 | XSG1.4 94.74,64.64 88.77,64.64 88.77,64.9 CD14.- | IC4.4 68.96,54.74 68.96,51.69 68.71,51.44 CD2.2 67.56,50.16 67.56,45.21 67.44,45.09 R12.2 66.93,43.81 66.93,41.27 R11.2 66.93,40.01 v66.93,39.12 | v59.56,38.86 59.56,36.58 59.31,36.32 U3.15 | XPITCHGYRO.2 82.93,11.56 82.93,14.61 CD18.2 83.95,15.88 89.03,15.88 89.03,18.41 89.15,18.54 89.15,19.68 C3.2 89.79,20.95 89.79,23.5 C11.2 89.79,24.77 89.79,27.3 C14.2 89.79,28.57 89.79,29.21 | R1.16 74.55,27.56 75.31,27.56 R1.15 75.82,27.56 76.58,27.56 R1.14 77.09,26.8 77.34,26.54 77.34,26.42 77.47,26.29 85.72,26.29 85.72,27.69 87.25,29.21 89.79,29.21 | 89.79,29.21 89.79,31.11 CD5.2 89.15,32.38 89.15,33.02 86.61,33.02 81.92,37.72 PROG.6 81.66,38.73 81.66,43.69 83.44,45.47 | 76.96,53.72 80.77,53.72 80.77,48.13 83.44,45.47
  Bottom 0.406: XFOOTPAD.1 6.99,77.72 33.91,77.72 v35.05,76.58 35.43,76.45 41.02,76.45 v42.42,75.06 | XPWM.9 v18.03,50.8 | v48.64,90.3 47.5,91.44 v46.48,91.44 | 8.76,16.64 6.99,16.64 XENC.1 | 8.76,16.64 v27.56,16.64 v30.48,16.64 | v14.48,21.21 13.84,20.57 9.27,20.57 8.76,20.07 8.76,16.64 | 49.4,8.26 49.91,8.76 XROLLGYRO.2 | 49.4,8.26 48.39,7.24 40.89,7.24 37.85,4.19 SERIAL.9 | 49.4,8.26 49.53,8.13 64.52,8.13 65.41,9.02 XYAWGYRO.2 66.67,9.02 67.56,8.13 81.03,8.13 81.92,9.02 XPITCHGYRO.2 83.19,11.3 84.07,12.19 94.11,12.19 94.74,12.83 X1.1 | XSG1.4 94.74,64.64 93.22,66.17 68.71,66.17 v68.58,66.29 68.2,66.17 v65.53,66.17 | v59.56,38.86 59.69,38.99 66.93,38.99 | 66.93,38.99 75.31,38.99 75.69,39.37 79.76,39.37 80.64,38.48 PROG.6 | 66.93,38.99 v66.93,39.12
  other vias: 7.37,72.26 3.68,72.01 3.68,35.56 9.14,35.43 9.65,45.34 11.94,41.66 11.68,49.78 9.53,53.85 11.81,62.99 44.96,69.72 40.01,74.8 43.69,73.66 54.1,85.22 48.64,94.49 43.31,96.39 36.58,97.41 26.67,96.65 26.8,94.11 21.46,95.76 11.3,95.25 88.77,70.23 91.57,74.8 80.14,85.98 83.06,86.11 87.88,84.96 79.25,75.06 76.07,75.82 81.28,61.47 91.69,64.77 90.68,58.93 90.42,53.85 80.77,53.59 90.17,49.15 84.96,33.4 93.09,26.92 93.34,31.75 85.47,28.57 78.87,30.35 77.09,15.37 73.66,9.91 57.53,9.91 42.67,10.92 53.21,14.48 66.29,17.78 70.23,15.11 85.6,15.24 64.64,29.08 59.82,29.72 53.59,26.8 49.4,22.23 42.55,21.97 46.86,33.78 28.57,33.66 36.58,40.77 40.13,40.01 40.39,33.53 42.42,33.66 33.66,33.53 22.48,34.67 21.46,37.47 22.23,47.62 18.41,42.29 14.61,42.16 41.27,17.02 47.12,27.69 42.29,27.56 62.23,32.38 43.69,66.29 62.23,79.88 59.44,75.31 60.96,71.12 54.36,75.82 35.69,73.53 35.81,70.74 25.91,78.11 20.95,81.41 17.02,82.42 16.13,86.23 10.16,86.11 9.78,82.17 9.91,79.88 10.03,77.47 54.61,16.89 61.47,48.01 65.79,47.62 68.71,42.67 73.79,42.55 77.34,42.8 76.2,45.21 67.94,46.74 68.71,39.5 69.6,33.66 73.66,33.4 80.52,43.31 57.91,48.13 51.69,48.9 51.18,46.74 49.53,47.62 50.16,53.21 49.91,50.93 34.16,65.15 35.94,65.15 61.34,52.07 68.2,53.47 64.64,74.93 69.85,79.76 62.36,92.71 90.42,92.33 5.97,90.17 9.27,90.81 11.3,89.15 36.2,80.77 20.07,90.81 27.18,91.06 40.77,84.33 50.8,91.57 81.28,69.22 76.45,70.23 79.25,70.1 27.05,22.23 30.86,21.72 28.19,30.1 6.35,35.31 1.65,48.26 9.02,24.64 12.06,35.56 19.18,39.37 30.48,38.61 27.69,42.04 20.95,18.67 21.34,16.26 20.45,12.83 11.81,13.21 12.06,21.21 11.94,16.51 24.51,22.61 7.75,11.05 10.03,3.43 90.3,10.41 96.65,44.83 96.9,71.75 89.92,97.41
  pour Top (isolate 0.254): 0,101.6 101.6,101.6 101.6,0 0,0
  pour Bottom (isolate 0.254): 0,101.6 101.6,101.6 101.6,0 0,0
KNOB1  (via drill 0.41)
  Top 0.178: v63.88,81.15 71.63,73.41 71.63,63.37 71.37,63.12 71.37,25.4 75.31,21.46 R1.2 75.82,20.07 77.22,18.67 79.12,18.67 79.12,20.07 R1.5 79.63,20.07 79.63,19.68 87.5,19.68 C3.1 88.27,19.68 v88.27,18.92 | v46.35,81.92 U10.13
  Bottom 0.178: v46.35,81.92 47.12,81.15 v63.88,81.15 | v88.27,18.92 93.47,18.92 94.74,17.65 X1.2
KNOB2  (via drill 0.41)
  Top 0.178: v75.31,19.3 74.55,20.07 R1.1 74.04,21.46 70.99,24.51 70.99,72.26 v69.85,73.41 | v77.47,19.43 77.47,19.68 77.85,20.07 R1.4 | v88.14,21.72 88.14,23.5 C11.1 | v45.34,81.92 45.34,83.44 U10.14
  Bottom 0.178: v75.31,19.3 76.45,20.45 77.47,20.45 | 88.14,20.45 94.74,20.45 X1.3 | 77.47,20.45 88.14,20.45 | 77.47,20.45 v77.47,19.43 | 88.14,20.45 v88.14,21.72 | v45.34,81.92 47.37,79.88 57.66,79.88 64.14,73.41 v69.85,73.41
KNOB3  (via drill 0.41)
  Top 0.178: R1.3 77.09,21.46 77.47,21.84 80.39,21.84 80.39,21.46 R1.6 80.9,21.46 80.9,21.84 82.04,21.84 87.5,27.3 C14.1 88.65,27.3 88.77,27.18 v88.77,26.54 | v44.07,75.95 42.8,77.22 U10.1
  Bottom 0.178: v44.07,75.95 47.37,72.64 91.57,72.64 99.19,65.02 99.19,25.65 97.92,25.65 X1.4 94.74,25.27 90.04,25.27 v88.77,26.54
L_PWM_DISABLE  (via drill 0.41)
  Top 0.178: U5.6 31.5,17.4 31.24,17.14 31.24,13.59 31.11,13.46 31.11,10.92 31.62,10.41 36.2,10.41 36.2,13.46 36.32,13.59 36.32,16.89 35.81,17.4 U5.3 35.81,19.3 36.07,19.56 v36.07,20.57 | v55.37,53.98 55.37,51.82 54.1,51.82 U2.40 | R4.4 60.58,77.22 60.58,76.83 65.41,76.83 70.61,71.63 70.61,56.52 v70.23,56.13 70.1,55.75 70.1,36.83 v67.69,34.42
  Bottom 0.178: v55.37,53.98 57.53,56.13 v70.23,56.13 | v36.07,20.57 40.39,24.89 58.17,24.89 v67.69,34.42
L_PWM_FWD  (via drill 0.41)
  Top 0.178: v54.48,39.12 54.48,47.5 54.1,47.5 U2.35 | v37.34,32.64 37.08,32.38 37.08,32 U4.2
  Bottom 0.178: v54.48,39.12 51.31,35.94 40.64,35.94 v37.34,32.64
L_PWM_REV  (via drill 0.41)
  Top 0.178: v54.74,48.64 54.1,48.64 U2.36 | v33.02,49.28 32.13,48.39 32.13,32.64 32.77,32 U4.5
  Bottom 0.178: v54.74,48.64 53.72,49.66 33.4,49.66 v33.02,49.28
LED1  (via drill 0.41)
  Top 0.178: v51.69,43.05 51.69,43.69 U2.32 | v58.42,42.29 59.44,41.27 59.44,41.15 LED1.A
  Bottom 0.178: v51.69,43.05 52.45,42.29 v58.42,42.29
LED2  (via drill 0.41)
  Top 0.178: v51.05,45.59 51.05,44.83 U2.31 | v58.67,44.96 59.44,44.96 LED2.A
  Bottom 0.178: v51.05,45.59 51.69,44.96 v58.67,44.96
LFOOTPAD1  (via drill 0.41)
  Top 0.178: C23.1 23.88,92.08 23.88,91.57 24.77,91.57 26.04,90.3 26.04,88.01 25.15,87.12 v25.15,85.98 25.15,82.68 20.95,78.49 R6.6 20.57,77.09 v20.57,76.33 | v31.88,85.98 31.88,85.6 32.13,85.34 U6.13
  Bottom 0.178: v25.15,85.98 v31.88,85.98 | v20.57,76.33 5.21,76.33 4.45,77.09 XFOOTPAD.2
LFOOTPAD2  (via drill 0.41)
  Top 0.178: v17.02,80.01 17.02,79.38 17.91,78.49 R6.4 | v36.83,85.98 36.83,90.93 37.97,92.08 C25.1 | v29.34,81.79 29.34,83.19 29.59,83.44 U6.15
  Bottom 0.178: XFOOTPAD.6 4.45,82.17 5.21,81.41 6.48,81.41 6.86,81.03 16,81.03 v17.02,80.01 17.4,80.14 20.7,83.44 26.8,83.44 | v36.83,85.98 34.29,83.44 26.8,83.44 | v29.34,81.79 29.21,81.92 28.32,81.92 26.8,83.44
LMIS  (via drill 0.41)
  Top 0.178: v30.35,87.5 30.35,88.27 R17.2 | R13.1 32.89,88.27 32.89,87.88 v32.51,87.5 32.38,87.88 32.38,95.38 32.89,95.89 C12.1 | v41.53,87.38 43.56,85.34 U10.15
  Bottom 0.178: v30.35,87.5 v32.51,87.5 32.89,87.38 v41.53,87.38
LMISIN  (via drill 0.41)
  Top 0.178: v34.42,91.06 34.42,89.66 34.54,89.53 R13.2
  Bottom 0.178: v34.42,91.06 33.66,91.82 5.46,91.82 1.91,88.27 1.91,53.98 3.43,53.98 XPWM.12
MCUXTAL1
  Top 0.178: U2.24 45.47,43.69 45.47,42.04 49.15,38.35 Q2.1 49.15,37.08 49.15,32.38 CX1.1
MCUXTAL2
  Top 0.178: U2.23 44.58,43.69 Q2.2 44.32,37.08 44.32,32.51 44.2,32.38 CX2.1
N$1
  Top 0.178: R19.1 81.79,75.56 81.79,78.36 IC2.3
N$2  (via drill 0.41)
  Top 0.178: v30.99,36.7 29.08,36.7 OSC2.3 | v34.29,36.7 34.54,36.96 34.54,37.47 RO1.2
  Bottom 0.178: v30.99,36.7 v34.29,36.7
N$3  (via drill 0.41)
  Top 0.178: U11.7 66.29,71.63 66.67,71.25 v66.67,70.87 66.67,66.04 68.71,64.01 68.71,62.48 68.58,62.36 68.58,57.28 68.2,56.9 IC4.3 | v73.41,70.99 73.41,71.63 73.53,71.75 C2.1
  Bottom 0.178: v73.41,70.99 73.28,70.87 v66.67,70.87
N$4  (via drill 0.41)
  Top 0.178: 69.34,67.18 69.34,62.1 IC4.5 | 69.34,67.18 69.34,68.33 68.58,69.09 68.58,70.61 67.56,71.63 U11.6 | v73.41,67.18 73.41,67.82 73.53,67.94 C1.1 | 69.34,67.18 v69.6,67.18
  Bottom 0.178: v69.6,67.18 v73.41,67.18
N$5  (via drill 0.41)
  Top 0.178: R7.2 75.82,55.24 75.82,57.78 R8.2 75.18,59.05 75.18,59.31 74.8,59.69 74.8,61.47 74.68,61.59 R3.1 73.53,62.87 73.53,63.5 v73.41,63.63 | IC4.6 v67.94,63.75
  Bottom 0.178: v67.94,63.75 68.07,63.63 v73.41,63.63
N$6
  Top 0.178: R10.1 60.71,61.59 60.83,61.47 60.83,59.69 61.21,59.31 61.21,59.05 R15.2 61.85,57.78 61.85,55.24 R18.2 62.36,53.98 62.36,53.85 65.53,53.85 66.42,54.74 IC4.2
N$8  (via drill 0.41)
  Top 0.178: v59.56,87.5 59.56,88.14 59.44,88.27 R21.1 | v85.34,81.79 85.47,81.66 85.47,79.76 IC2.6 85.98,79.12 86.74,79.12 IC2.7
  Bottom 0.178: v59.56,87.5 63.75,83.31 83.19,83.31 84.71,81.79 v85.34,81.79
N$9  (via drill 0.41)
  Top 0.178: v53.98,90.3 53.98,89.53 R22.1 | v85.47,90.04 85.47,89.28 IC2.11 85.98,88.65 86.74,88.65 IC2.10
  Bottom 0.178: v53.98,90.3 54.23,90.04 v85.47,90.04
N$10
  Top 0.178: R19.2 83.44,75.56 83.44,78.36 IC2.4
N$11
  Top 0.178: C4.1 53.09,20.95 53.21,20.83 53.21,20.57 53.34,20.45 60.33,20.45 60.33,22.48 58.55,24.26 58.04,24.26 58.04,24.64 U3.1
N$12
  Top 0.178: C5.1 57.02,22.23 56.77,22.48 56.77,27.18 57.91,28.32 61.34,28.32 61.34,26.54 U3.4
N$13
  Top 0.178: R20.2 83.44,92.08 83.44,89.28 IC2.13
N$14
  Top 0.178: LED1.C R11.1
N$15
  Top 0.178: R20.1 81.79,92.08 81.79,89.28 IC2.14
N$16
  Top 0.178: LED2.C R12.1
N$17  (via drill 0.41)
  Top 0.178: v80.26,65.28 80.26,77.72 79.63,78.36 IC2.1
  Bottom 0.178: v80.26,65.28 88.52,57.02 94.74,57.02 XSG1.2
N$18  (via drill 0.41)
  Top 0.178: v85.47,65.28 85.47,66.17 80.64,70.99 IC2.2
  Bottom 0.178: v85.47,65.28 89.92,60.83 94.74,60.83 XSG1.3
N$19  (via drill 0.41)
  Top 0.178: v83.57,83.95 79.63,87.88 IC2.16
  Bottom 0.178: v83.57,83.95 84.96,82.55 93.34,82.55 94.74,81.15 XSG2.2
N$20
  Top 0.178: C5.2 58.67,22.23 58.55,22.35 58.55,22.86 57.15,24.26 57.15,26.92 58.17,27.94 60.96,27.94 60.96,24.26 62.61,24.26 62.61,24.64 U3.5
N$21
  Top 0.178: IC2.15 80.64,93.6 80.9,93.85 96.27,93.85 96.27,91.44 98.81,88.9 98.81,86.23 97.92,85.34 XSG2.3
N$22  (via drill 0.41)
  Top 0.178: v56.01,25.65 56.01,23.5 54.74,22.23 C4.2 | v58.42,27.18 60.07,27.18 60.07,26.54 U3.3
  Bottom 0.178: v56.01,25.65 57.53,27.18 v58.42,27.18
N$24
  Top 0.178: C6.1 62.1,22.23 60.07,24.26 59.31,24.26 59.31,24.64 U3.2
N$26
  Top 0.178: C7.2 68.83,22.23 68.71,22.35 68.71,25.53 67.31,26.92 64.39,26.92 64.39,26.54 U3.6
N$31  (via drill 0.41)
  Top 0.178: v86.74,81.03 88.01,79.76 IC2.8 | v74.3,81.03 74.17,81.15 74.17,81.79 SJ1.2
  Bottom 0.178: v74.3,81.03 v86.74,81.03
N$32  (via drill 0.41)
  Top 0.178: v85.34,85.22 88.01,87.88 IC2.9 | v74.8,84.84 74.17,85.47 74.17,85.6 SJ2.2
  Bottom 0.178: v85.34,85.22 84.96,84.84 v74.8,84.84
N$33  (via drill 0.41)
  Top 0.178: v59.94,31.75 59.94,34.29 60.07,34.42 U3.14 | v29.21,26.04 28.19,25.02 28.19,17.02 28.57,16.64 28.57,6.86 28.45,6.73 28.45,5.97 29.46,4.95 31.75,4.95 31.75,4.45 SERIAL.5
  Bottom 0.178: v59.94,31.75 56.9,28.7 38.73,28.7 35.81,25.78 29.46,25.78 v29.21,26.04
N$34  (via drill 0.41)
  Top 0.178: v60.83,33.66 60.83,33.91 61.34,34.42 U3.13 | v41.15,30.35 39.5,28.7 39.5,10.16 35.81,6.48 35.81,5.97 34.8,4.95 33.27,4.95 33.27,3.43 32.51,2.67 29.97,2.67 29.97,3.17 SERIAL.3
  Bottom 0.178: v60.83,33.66 58.04,30.86 41.66,30.86 v41.15,30.35
N$35  (via drill 0.41)
  Top 0.178: v63.5,22.99 65.15,24.64 U3.7 | v28.96,18.16 29.21,17.91 29.21,6.99 SERIAL.4
  Bottom 0.178: v63.5,22.99 58.67,18.16 v28.96,18.16
N$36  (via drill 0.41)
  Top 0.178: v65.41,22.86 65.41,23.62 66.42,24.64 U3.8
  Bottom 0.178: v65.41,22.86 55.5,12.95 48.51,12.95 48.01,12.45 48.01,11.43 48.13,11.3 48.13,7.75 33.78,7.75 32.77,6.73 SERIAL.6
OC1A  (via drill 0.41)
  Top 0.178: 38.86,46.74 38.48,46.74 U2.15 | 38.86,46.74 38.86,29.84 v37.21,28.19 | v35.43,26.54 35.43,25.78 U4.12 | v51.69,58.42 55.5,62.23 55.5,83.19 56.26,83.95 R4.16 | v41.27,58.42 40.51,57.66 40.51,48.39 38.86,46.74 | v31.62,26.54 31.62,25.78 U4.9
  Bottom 0.178: v37.21,28.19 35.56,26.54 v35.43,26.54 v31.62,26.54 | v41.27,58.42 v51.69,58.42
OC1B  (via drill 0.41)
  Top 0.178: v55.88,59.56 55.88,75.56 57.53,77.22 R4.2 | v41.27,57.4 40.89,57.02 v40.89,46.61 | v36.7,46.61 37.34,45.97 U2.16 38.1,45.85 U4.1 37.85,30.1 v37.08,29.34 | v34.29,29.34 U4.4
  Bottom 0.178: v55.88,59.56 53.72,57.4 v41.27,57.4 | v36.7,46.61 v40.89,46.61 | v34.29,29.34 v37.08,29.34
PB0  (via drill 0.41)
  Top 0.178: v36.07,50.67 37.34,50.67 U2.10 | v27.69,48.13 v29.59,50.04 | v13.34,44.7 13.21,44.58 13.21,30.99 | 13.21,30.99 13.21,30.73 U8.4 | 13.21,30.99 14.61,29.59 14.61,22.35 12.83,20.57 12.83,11.68 U7.4
  Bottom 0.178: v36.07,50.67 35.43,50.04 v29.59,50.04 | v27.69,48.13 24.26,44.7 v13.34,44.7
PB2  (via drill 0.41)
  Top 0.178: v36.07,48.9 36.07,49.15 37.34,49.15 U2.12 | v15.62,49.28 10.79,44.45 10.79,29.97 10.92,29.84 13.72,29.84 13.72,27.43 13.21,26.92 U8.7 11.18,26.42 10.79,26.04 10.79,24.13 11.18,23.75 11.18,15.49 10.79,15.11 10.79,8.26 11.18,7.87 U7.7
  Bottom 0.178: v36.07,48.9 35.69,48.51 30.48,48.51 29.72,49.28 v15.62,49.28
PB3  (via drill 0.41)
  Top 0.178: v39.24,48.26 38.48,48.26 U2.13 | v22.48,43.94 18.41,39.88 18.41,26.42 17.4,25.4 17.4,25.15 17.14,24.89 v17.14,20.95 | v13.59,18.16 13.72,18.03 13.72,14.22 U7.3
  Bottom 0.178: v39.24,48.26 38.73,47.75 28.32,47.75 24.51,43.94 v22.48,43.94 | v17.14,20.95 14.35,18.16 v13.59,18.16
PB4  (via drill 0.41)
  Top 0.178: v36.07,44.7 35.94,44.83 35.94,47.5 37.34,47.5 U2.14 | v16.13,41.27 14.22,39.37 14.22,33.27 U8.3
  Bottom 0.178: v36.07,44.7 32.64,41.27 v16.13,41.27
PITCH_RATE  (via drill 0.41)
  Top 0.178: v42.8,46.61 42.8,59.31 U2.60 | v90.93,30.61 90.81,30.48 90.81,16.89 85.47,11.56 XPITCHGYRO.3
  Bottom 0.178: v42.8,46.61 42.93,46.48 49.15,46.48 51.82,43.81 77.72,43.81 v90.93,30.61
R_PWM_DISABLE  (via drill 0.41)
  Top 0.178: U5.9 32,11.18 32.38,10.79 35.31,10.79 35.31,11.18 U5.12 v35.56,13.84 | v52.2,51.31 52.2,52.32 52.96,52.32 U2.41 | v73.03,73.66 72.64,73.28 72.64,63.37 72.9,63.12 72.9,56.9 v72.14,56.13 v72.14,30.61 | v58.67,81.92 58.55,82.04 58.55,83.69 58.8,83.95 R4.14
  Bottom 0.178: v52.2,51.31 53.34,50.16 66.17,50.16 v72.14,56.13 | v73.03,73.66 64.77,81.92 v58.67,81.92 | v35.56,13.84 37.59,15.88 57.4,15.88 v72.14,30.61
R_PWM_FWD  (via drill 0.41)
  Top 0.178: v50.67,30.1 52.45,31.88 52.45,49.15 52.96,49.15 U2.37 | v33.27,29.34 33.27,25.78 U4.10
  Bottom 0.178: v50.67,30.1 50.16,29.59 37.85,29.59 37.34,30.1 34.04,30.1 v33.27,29.34
R_PWM_REV  (via drill 0.41)
  Top 0.178: v50.67,27.94 55.5,32.77 55.5,49.91 54.1,49.91 U2.38 | v37.85,26.54 37.08,25.78 U4.13
  Bottom 0.178: v50.67,27.94 49.28,26.54 v37.85,26.54
RFOOTPAD1  (via drill 0.41)
  Top 0.178: C24.1 28.96,92.08 29.08,91.95 29.08,91.69 30.73,90.04 31.11,90.04 U6.14 30.86,83.44 30.48,83.06 30.48,75.56 20.32,75.56 19.81,76.07 19.81,76.96 19.68,77.09 R6.5 19.18,78.49 v18.41,79.25
  Bottom 0.178: v18.41,79.25 18.03,78.87 5.21,78.87 4.45,79.63 XFOOTPAD.4
RFOOTPAD2  (via drill 0.41)
  Top 0.178: C26.1 28.96,97.16 29.08,97.28 29.08,97.54 29.21,97.66 31.75,97.66 31.75,87.12 33.4,85.47 33.4,85.34 U6.12 33.4,83.44 31.75,81.79 31.75,76.96 31.62,76.83 31.62,73.66 20.57,73.66 17.14,77.09 R6.3 16.64,78.49 16.64,79.38 v14.22,81.79
  Bottom 0.178: v14.22,81.79 12.32,83.69 5.46,83.69 4.45,84.71 XFOOTPAD.8
RIGHT_ACCEL  (via drill 0.41)
  Top 0.178: v47.37,64.77 47.37,63.63 45.47,61.72 45.47,60.45 U2.57 | v63.88,64.64 66.42,62.1 IC4.7 | v75.06,63.63 75.06,62.99 75.18,62.87 R3.2
  Bottom 0.178: v47.37,64.77 47.5,64.64 v63.88,64.64 64.26,64.52 74.17,64.52 v75.06,63.63
RMIS  (via drill 0.41)
  Top 0.178: v25.02,90.3 25.02,89.53 R16.2 | v37.59,90.3 37.97,89.92 37.97,89.53 R9.1 | v42.42,91.19 42.42,91.44 43.05,92.08 C13.1 | v47.62,87.38 U10.12
  Bottom 0.178: v25.02,90.3 v37.59,90.3 37.97,90.42 41.66,90.42 v42.42,91.19 42.8,91.06 43.94,91.06 v47.62,87.38
RMISIN  (via drill 0.41)
  Top 0.178: v38.48,71.37 38.48,80.39 39.5,81.41 39.5,88.14 39.62,88.27 R9.2
  Bottom 0.178: v38.48,71.37 30.73,63.63 30.73,61.47 26.67,57.4 8.13,57.4 6.99,56.26 XPWM.13
ROLL_RATE  (via drill 0.41)
  Top 0.178: v44.58,45.59 44.58,59.31 U2.58 | v41.4,42.42 41.27,42.29 41.27,31.24 45.85,26.67 45.85,9.02 46.61,8.26 51.44,8.26 51.44,9.02 XROLLGYRO.3
  Bottom 0.178: v41.4,42.42 v44.58,45.59
RXD0  (via drill 0.41)
  Top 0.178: v36.96,59.94 36.96,57.4 37.34,57.4 U2.2 | v78.36,52.83 78.36,38.73 PROG.4 | v65.15,37.21 65.15,37.85 63.88,37.85 63.37,37.34 63.37,36.58 63.12,36.32 U3.12
  Bottom 0.178: v36.96,59.94 37.34,60.33 61.21,60.33 64.26,57.28 73.91,57.28 v78.36,52.83 | v65.15,37.21 65.41,36.96 77.34,36.96 78.11,37.72 PROG.4
RXD1  (via drill 0.41)
  Top 0.178: v51.69,34.42 51.69,36.83 47.88,40.64 47.88,43.69 U2.27 | v66.04,33.78 66.42,34.16 66.42,34.42 U3.9
  Bottom 0.178: v51.69,34.42 51.82,34.54 65.28,34.54 v66.04,33.78
SCK  (via drill 0.41)
  Top 0.178: v39.75,50.42 39.75,50.29 38.48,50.29 U2.11 | v48.64,50.42 v50.16,48.9 | v72.9,45.72 77.6,41.02 77.6,36.96 78.36,36.2 PROG.3
  Bottom 0.178: v39.75,50.42 v48.64,50.42 | v50.16,48.9 53.34,45.72 v72.9,45.72
SG1
  Top 0.178: R23.2 65.02,88.27 64.9,88.14 64.9,87.88 64.77,87.76 61.09,87.76 61.09,88.27 R21.2 59.94,89.53 59.82,89.66 59.82,91.44 59.44,91.82 59.44,92.08 C19.1 58.29,93.34 58.29,93.85 51.18,93.85 46.86,89.53 46.86,87.12 46.99,87 46.99,83.06 47.12,82.93 47.12,79.38 47.37,79.12 U10.5
SG2
  Top 0.178: R22.2 54.86,89.53 54.74,89.66 54.74,91.44 54.36,91.82 54.36,92.08 C20.1 53.21,92.08 53.21,91.82 50.93,89.53 R24.2 49.78,88.27 49.78,88.01 49.53,87.76 49.53,83.06 48.26,81.79 48.26,75.82 45.47,75.82 44.07,77.22 U10.2
SGPWR  (via drill 0.41)
  Top 0.178: XSG1.1 97.92,53.59 98.81,54.48 98.81,75.06 97.92,75.95 XSG2.1 | SJ2.3 75.69,85.6 77.72,83.57 77.72,62.1 82.93,56.9 IC3.1 82.93,54.74 82.93,50.67 CD13.+ 83.82,50.67 v84.33,51.18
  Bottom 0.178: v84.33,51.18 93.73,51.18 94.74,52.2 XSG1.1
TEMPA  (via drill 0.41)
  Top 0.178: v17.14,91.06 17.14,95.38 17.65,95.89 C27.1 | v25.91,84.2 28.32,81.79 28.32,79.12 U6.1
  Bottom 0.178: v25.91,84.2 24,84.2 v17.14,91.06 16.76,90.93 13.84,88.01 2.29,88.01 2.29,58.42 3.43,57.28 4.95,57.28 4.95,58.55 5.97,59.56 5.97,60.33 XPWM.17
TEMPB  (via drill 0.41)
  Top 0.178: v34.04,94.11 34.04,93.34 C28.1 | v36.45,91.69 36.2,91.44 36.2,87.5 34.29,85.6 34.29,80.14 33.91,79.76 33.91,79.12 U6.5 33.4,77.22 33.4,74.68 v32.38,73.66
  Bottom 0.178: v36.45,91.69 v34.04,94.11 | v32.38,73.66 18.41,73.66 7.11,62.36 5.46,62.36 4.45,61.34 XPWM.18
TEMPC  (via drill 0.41)
  Top 0.178: C29.1 22.73,97.16 20.95,98.93 12.57,98.93 8.13,94.49 8.13,88.65 5.21,85.72 5.21,64.9 5.97,64.14 XPWM.19 | v29.72,76.58 29.72,77.22 U6.2
  Bottom 0.178: v29.72,76.58 30.35,77.22 32.64,77.22 33.15,76.71 33.15,75.18 17.78,75.18 6.73,64.14 XPWM.19
TEMPD  (via drill 0.41)
  Top 0.178: v6.99,86.49 12.57,92.08 C30.1 | v32.38,76.45 U6.4
  Bottom 0.178: v6.99,86.49 6.73,86.23 3.43,86.23 2.67,85.47 2.67,75.56 | 2.67,75.56 2.67,64.14 3.43,64.14 XPWM.20 | v32.38,76.45 31.5,75.56 2.67,75.56
TXD0  (via drill 0.41)
  Top 0.178: v39.24,56.77 39.24,56.64 38.48,56.64 U2.3 | v55.88,57.02 56.9,56.01 56.9,33.78 59.82,30.86 63.88,30.86 63.88,34.42 U3.11 v64.14,37.08
  Bottom 0.178: v39.24,56.77 39.37,56.64 41.53,56.64 41.91,57.02 v55.88,57.02 | v64.14,37.08 64.77,36.45 75.06,36.45 75.56,35.94 PROG.1
TXD1  (via drill 0.41)
  Top 0.178: v51.44,40.77 48.64,43.56 48.64,43.69 U2.28 | v63.75,39.88 65.91,37.72 65.91,36.58 65.66,36.32 U3.10
  Bottom 0.178: v51.44,40.77 52.32,39.88 v63.75,39.88
VBATSENSE  (via drill 0.41)
  Top 0.178: v15.11,73.79 15.11,75.44 13.59,76.96 13.59,78.99 13.46,79.12 13.46,85.22 14.1,85.85 14.1,88.14 14.22,88.27 R5.2
  Bottom 0.178: v15.11,73.79 4.95,63.63 4.95,62.48 4.32,62.48 3.94,62.1 3.43,62.1 2.67,61.34 2.67,59.05 3.43,59.05 XPWM.16
VCC  (via drill 0.41)
  Top 0.406: CD16.1 18.29,92.08 18.29,89.53 R14.1 18.29,88.27 18.29,85.22 R6.13 | R6.14 17.14,84.58 17.91,84.58 R6.13 | R6.13 18.41,84.58 19.18,84.58 R6.12 19.68,84.58 20.45,84.58 R6.11 20.95,85.22 20.95,86.49 22.73,88.27 R16.1 23.88,88.27 23.88,87.88 v24.26,87.5 | v26.8,88.27 27.81,88.27 R17.1 28.45,88.27 28.45,85.34 U6.16 v28.57,82.68 | CD15.1 86.23,75.56 84.71,77.09 84.71,78.36 IC2.5 84.45,82.55 | CD11.1 86.23,92.08 84.58,90.42 84.58,89.28 IC2.12 84.45,82.55 | 59.56,82.8 59.56,83.31 60.07,83.82 60.07,83.95 R4.13 | 59.56,82.8 59.56,78.87 59.31,78.61 R4.3 | 41.72,82.87 42.29,83.44 U10.16 | 41.72,82.87 41.53,82.68 41.53,69.22 38.48,66.17 LAVCC1.1 | v59.31,82.8 59.56,82.8 | v41.78,82.8 41.72,82.87 | v79.12,82.55 84.45,82.55 | CD18.1 81.15,14.61 80.39,13.84 80.39,11.56 XPITCHGYRO.1 | XYAWGYRO.1 63.88,11.56 63.88,13.84 64.64,14.61 CD12.1 64.64,15.88 64.64,20.95 C6.2 | X1.5 97.92,29.46 98.93,30.48 98.93,34.29 97.92,35.31 X1.7 | R1.13 78.36,27.56 79.12,27.56 R1.12 79.63,27.56 80.39,27.56 R1.11 80.9,28.19 80.9,31.11 | 80.9,31.11 87.5,31.11 CD5.1 88.65,31.11 88.65,30.61 v88.9,30.35 | v62.61,38.1 60.96,39.75 60.96,45.47 61.21,45.47 65.91,50.16 CD2.1 65.91,51.44 v64.39,52.96 | v57.78,37.08 U3.16 | v64.39,54.99 64.39,59.18 65.15,59.94 IC4.8 | 80.9,31.11 77.47,34.54 77.47,36.32 76.58,37.21 76.58,37.47 PROG.2 | 47.37,12.19 47.37,11.56 XROLLGYRO.1 | 47.37,12.19 47.37,13.84 48.13,14.61 CD10.1 | CD17.1 16.26,17.14 16.26,16.76 16.76,16.26 17.78,16.26 U7.20 17.65,12.19 v17.65,11.43 | SERIAL.8 35.05,6.99 35.05,8.38 37.85,11.18 U5.14 38.35,13.08 38.99,13.72 38.99,23.24 38.35,23.88 U4.14
  Top 0.406: v45.34,54.99 49.28,58.93 49.28,59.31 U2.52 49.28,60.45 49.28,63.37 CD3.1 50.16,64.14 50.8,64.77 50.8,73.79 52.2,75.18 52.2,80.64 v50.93,81.92 | CD4.1 16.26,36.2 16.26,34.8 17.53,33.53 17.53,33.27 U8.20 17.78,26.8 v17.65,26.67 | 25.91,26.54 25.91,27.3 CD6.1 25.91,28.57 25.91,43.56 26.29,43.94 26.29,44.07 26.92,44.7 | 25.91,26.54 25.91,15.88 CD7.1 25.27,14.61 25.27,14.22 v24.89,13.84 | v42.42,45.59 42.93,45.09 42.93,44.83 U2.21 | v31.11,45.59 30.35,45.59 CD1.+ 27.94,45.72 26.92,44.7 | v25.78,26.54 25.91,26.54 | IC1.3 26.8,44.83 26.92,44.7 | 47.37,12.19 v48.77,12.19
  Bottom 0.406: v26.8,88.27 26.04,87.5 v24.26,87.5 | 50.93,82.8 v41.78,82.8 41.4,82.68 v28.57,82.68 | 50.93,82.8 v59.31,82.8 59.69,82.68 78.99,82.68 v79.12,82.55 | 74.42,12.19 65.02,12.19 64.14,11.3 XYAWGYRO.1 62.87,11.3 61.98,12.19 v48.77,12.19 | 74.42,12.19 78.49,12.19 79.38,11.3 XPITCHGYRO.1 | PROG.2 v62.61,38.1 62.23,37.97 58.67,37.97 v57.78,37.08 | v64.39,52.96 v64.39,54.99 | 89.79,29.72 89.53,29.72 v88.9,30.35 | 89.79,29.72 94.11,29.72 94.74,29.08 X1.5 | 74.42,12.19 74.42,22.48 82.68,22.48 89.79,29.59 89.79,29.72 | 20.07,9.02 24,5.08 30.86,5.08 | 20.07,9.02 v17.65,11.43 | 30.86,5.08 33.15,5.08 34.04,5.97 SERIAL.8 | XROLLGYRO.1 46.35,9.02 45.59,8.26 32.26,8.26 30.86,6.86 30.86,5.08 | v45.34,54.99 44.07,53.72 27.18,53.72 IC1.3 | XENC.4 3.43,19.68 2.54,20.57 2.54,27.94 4.83,27.94 5.71,27.05 XENC.9 v17.65,26.67 18.03,26.54 v25.78,26.54 | v31.11,45.59 v42.42,45.59 | v24.89,13.84 20.07,9.02 | v50.93,81.92 50.93,82.8
VDD  (via drill 0.41)
  Top 0.178: v26.8,35.56 26.8,36.32 OSC2.1 | v32.89,35.18 32.89,37.47 RO1.1
  Bottom 0.178: v26.8,35.56 27.18,35.18 v32.89,35.18
YAW_RATE  (via drill 0.41)
  Top 0.178: v43.56,45.72 43.56,59.31 U2.59 | v68.96,17.78 68.96,11.56 XYAWGYRO.3
  Bottom 0.178: v43.56,45.72 40.64,42.8 40.64,41.53 79.38,41.53 82.42,38.48 82.42,22.99 74.17,22.99 v68.96,17.78
(copper drawn outside any net)
  shapes: Top area x1